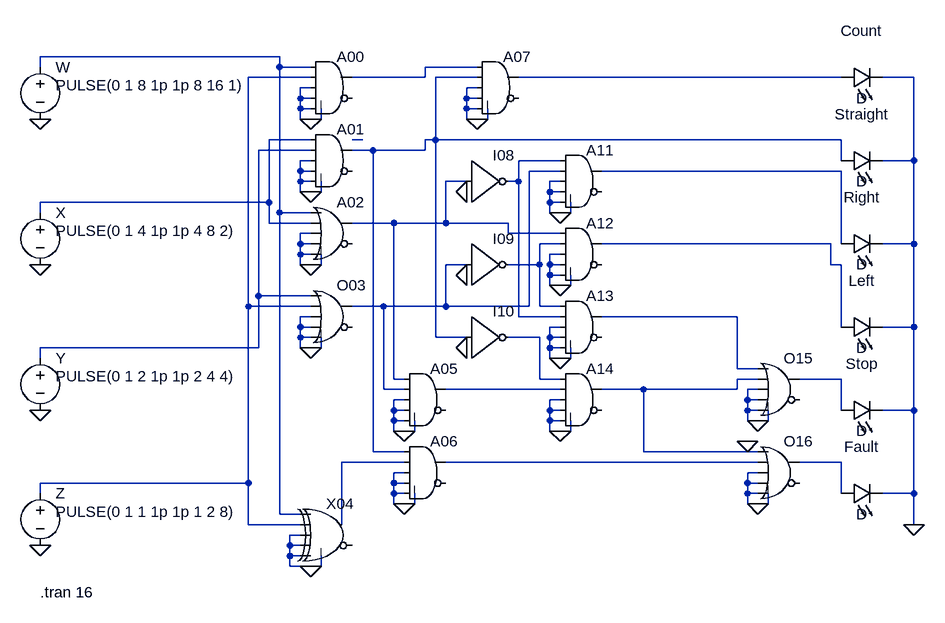
[diagram p0: schematic Prac_1_Analog_sim.asc]
Prac_1_Analog_sim.asc, the LTspice schematic file:
Version 4.1
SHEET 1 880 680
WIRE -464 -400 -832 -400
WIRE -832 -384 -832 -400
WIRE -464 -384 -464 -400
WIRE -416 -384 -464 -384
WIRE -160 -384 -240 -384
WIRE -416 -368 -512 -368
WIRE -240 -368 -240 -384
WIRE -240 -368 -352 -368
WIRE -160 -368 -224 -368
WIRE 400 -368 -96 -368
WIRE 512 -368 464 -368
WIRE -416 -352 -432 -352
WIRE -160 -352 -176 -352
WIRE -432 -336 -432 -352
WIRE -416 -336 -432 -336
WIRE -176 -336 -176 -352
WIRE -160 -336 -176 -336
WIRE -432 -320 -432 -336
WIRE -416 -320 -432 -320
WIRE -176 -320 -176 -336
WIRE -160 -320 -176 -320
WIRE -432 -304 -432 -320
WIRE -416 -304 -432 -304
WIRE -400 -304 -400 -320
WIRE -400 -304 -416 -304
WIRE -176 -304 -176 -320
WIRE -160 -304 -176 -304
WIRE -144 -304 -144 -320
WIRE -144 -304 -160 -304
WIRE -416 -272 -480 -272
WIRE -336 -272 -352 -272
WIRE -224 -272 -224 -368
WIRE -224 -272 -240 -272
WIRE 400 -272 -224 -272
WIRE -416 -256 -496 -256
WIRE -320 -256 -352 -256
WIRE -240 -256 -240 -272
WIRE -240 -256 -320 -256
WIRE -416 -240 -432 -240
WIRE -32 -240 -96 -240
WIRE 400 -240 400 -272
WIRE 512 -240 512 -368
WIRE 512 -240 464 -240
WIRE -432 -224 -432 -240
WIRE -416 -224 -432 -224
WIRE -32 -224 -80 -224
WIRE 400 -224 32 -224
WIRE -432 -208 -432 -224
WIRE -416 -208 -432 -208
WIRE -176 -208 -208 -208
WIRE -96 -208 -96 -240
WIRE -96 -208 -112 -208
WIRE -32 -208 -48 -208
WIRE -432 -192 -432 -208
WIRE -416 -192 -432 -192
WIRE -400 -192 -400 -208
WIRE -400 -192 -416 -192
WIRE -48 -192 -48 -208
WIRE -32 -192 -48 -192
WIRE -480 -176 -480 -272
WIRE -480 -176 -832 -176
WIRE -48 -176 -48 -192
WIRE -32 -176 -48 -176
WIRE -832 -160 -832 -176
WIRE -464 -160 -464 -384
WIRE -416 -160 -464 -160
WIRE -48 -160 -48 -176
WIRE -32 -160 -48 -160
WIRE -16 -160 -16 -176
WIRE -16 -160 -32 -160
WIRE -480 -144 -480 -176
WIRE -416 -144 -480 -144
WIRE -288 -144 -352 -144
WIRE -208 -144 -208 -208
WIRE -208 -144 -288 -144
WIRE -112 -144 -208 -144
WIRE -416 -128 -432 -128
WIRE -112 -128 -112 -144
WIRE -32 -128 -112 -128
WIRE -432 -112 -432 -128
WIRE -416 -112 -432 -112
WIRE -32 -112 -64 -112
WIRE 384 -112 32 -112
WIRE 400 -112 400 -224
WIRE 512 -112 512 -240
WIRE 512 -112 464 -112
WIRE -432 -96 -432 -112
WIRE -416 -96 -432 -96
WIRE -32 -96 -48 -96
WIRE -432 -80 -432 -96
WIRE -416 -80 -432 -80
WIRE -400 -80 -400 -96
WIRE -400 -80 -416 -80
WIRE -176 -80 -208 -80
WIRE -64 -80 -64 -112
WIRE -64 -80 -112 -80
WIRE -48 -80 -48 -96
WIRE -32 -80 -48 -80
WIRE 384 -80 384 -112
WIRE 400 -80 384 -80
WIRE -48 -64 -48 -80
WIRE -32 -64 -48 -64
WIRE -48 -48 -48 -64
WIRE -32 -48 -48 -48
WIRE -16 -48 -16 -64
WIRE -16 -48 -32 -48
WIRE -496 -32 -496 -256
WIRE -416 -32 -496 -32
WIRE -512 -16 -512 -368
WIRE -416 -16 -512 -16
WIRE -304 -16 -352 -16
WIRE -208 -16 -208 -80
WIRE -208 -16 -304 -16
WIRE -80 -16 -80 -224
WIRE -80 -16 -208 -16
WIRE -64 -16 -64 -80
WIRE -32 -16 -64 -16
WIRE -416 0 -432 0
WIRE -96 0 -96 -208
WIRE -32 0 -96 0
WIRE 240 0 32 0
WIRE -432 16 -432 0
WIRE -416 16 -432 16
WIRE -32 16 -48 16
WIRE 400 16 400 -80
WIRE 512 16 512 -112
WIRE 512 16 464 16
WIRE -432 32 -432 16
WIRE -416 32 -432 32
WIRE -224 32 -224 -272
WIRE -176 32 -224 32
WIRE -64 32 -112 32
WIRE -48 32 -48 16
WIRE -32 32 -48 32
WIRE -496 48 -496 -32
WIRE -496 48 -832 48
WIRE -432 48 -432 32
WIRE -416 48 -432 48
WIRE -400 48 -400 32
WIRE -400 48 -416 48
WIRE -48 48 -48 32
WIRE -32 48 -48 48
WIRE -832 64 -832 48
WIRE -48 64 -48 48
WIRE -32 64 -48 64
WIRE -16 64 -16 48
WIRE -16 64 -32 64
WIRE 240 80 240 0
WIRE 272 80 240 80
WIRE -288 96 -288 -144
WIRE -272 96 -288 96
WIRE -64 96 -64 32
WIRE -32 96 -64 96
WIRE 272 96 240 96
WIRE 400 96 336 96
WIRE -304 112 -304 -16
WIRE -272 112 -304 112
WIRE -32 112 -208 112
WIRE 96 112 32 112
WIRE 240 112 240 96
WIRE 240 112 96 112
WIRE 272 112 256 112
WIRE -272 128 -288 128
WIRE -32 128 -48 128
WIRE 256 128 256 112
WIRE 272 128 256 128
WIRE -288 144 -288 128
WIRE -272 144 -288 144
WIRE -48 144 -48 128
WIRE -32 144 -48 144
WIRE 256 144 256 128
WIRE 272 144 256 144
WIRE 400 144 400 96
WIRE 512 144 512 16
WIRE 512 144 464 144
WIRE -288 160 -288 144
WIRE -272 160 -288 160
WIRE -48 160 -48 144
WIRE -32 160 -48 160
WIRE 256 160 256 144
WIRE 272 160 256 160
WIRE 288 160 288 144
WIRE 288 160 272 160
WIRE -288 176 -288 160
WIRE -272 176 -288 176
WIRE -256 176 -256 160
WIRE -256 176 -272 176
WIRE -48 176 -48 160
WIRE -32 176 -48 176
WIRE -16 176 -16 160
WIRE -16 176 -32 176
WIRE -320 208 -320 -256
WIRE -272 208 -320 208
WIRE 96 208 96 112
WIRE 272 208 96 208
WIRE -272 224 -368 224
WIRE 272 224 -208 224
WIRE 400 224 336 224
WIRE -272 240 -288 240
WIRE 272 240 256 240
WIRE -512 256 -512 -16
WIRE -512 256 -832 256
WIRE -288 256 -288 240
WIRE -272 256 -288 256
WIRE 256 256 256 240
WIRE 272 256 256 256
WIRE -832 272 -832 256
WIRE -288 272 -288 256
WIRE -272 272 -288 272
WIRE 256 272 256 256
WIRE 272 272 256 272
WIRE 400 272 400 224
WIRE 512 272 512 144
WIRE 512 272 464 272
WIRE -288 288 -288 272
WIRE -272 288 -288 288
WIRE -256 288 -256 272
WIRE -256 288 -272 288
WIRE 256 288 256 272
WIRE 272 288 256 288
WIRE 288 288 288 272
WIRE 288 288 272 288
WIRE -464 304 -464 -160
WIRE -432 304 -464 304
WIRE -512 320 -512 256
WIRE -432 320 -512 320
WIRE -368 320 -368 224
WIRE 512 320 512 272
WIRE -432 336 -448 336
WIRE -448 352 -448 336
WIRE -432 352 -448 352
WIRE -448 368 -448 352
WIRE -432 368 -448 368
WIRE -448 384 -448 368
WIRE -416 384 -448 384
WIRE -400 384 -400 368
WIRE -400 384 -416 384
FLAG 512 320 0
FLAG -416 -304 0
FLAG -416 -192 0
FLAG -160 -304 0
FLAG -416 -80 0
FLAG -416 48 0
FLAG -176 -192 0
FLAG -176 -64 0
FLAG -32 176 0
FLAG -32 -160 0
FLAG -32 -48 0
FLAG -32 64 0
FLAG -272 288 0
FLAG -416 384 0
FLAG 272 160 0
FLAG -272 176 0
FLAG 272 288 0
FLAG 256 192 0
FLAG -832 -304 0
FLAG -832 -80 0
FLAG -832 144 0
FLAG -832 352 0
FLAG -176 48 0
DATAFLAG -512 80 ""
DATAFLAG -448 304 ""
SYMBOL Digital\\and -384 -416 R0
SYMATTR InstName A00
SYMBOL LED 400 -352 R270
WINDOW 0 72 32 VTop 2
WINDOW 3 0 32 VBottom 2
SYMATTR InstName Count
SYMBOL LED 400 -96 R270
WINDOW 0 72 32 VTop 2
WINDOW 3 0 32 VBottom 2
SYMATTR InstName Right
SYMBOL LED 400 32 R270
WINDOW 0 72 32 VTop 2
WINDOW 3 0 32 VBottom 2
SYMATTR InstName Left
SYMBOL LED 400 -224 R270
WINDOW 0 72 32 VTop 2
WINDOW 3 0 32 VBottom 2
SYMATTR InstName Straight
SYMBOL LED 400 160 R270
WINDOW 0 72 32 VTop 2
WINDOW 3 0 32 VBottom 2
SYMATTR InstName Stop
SYMBOL LED 400 288 R270
WINDOW 0 72 32 VTop 2
WINDOW 3 0 32 VBottom 2
SYMATTR InstName Fault
SYMBOL Digital\\and -384 -304 R0
SYMATTR InstName A01
SYMBOL Digital\\and -128 -416 R0
SYMATTR InstName A07
SYMBOL Digital\\or -384 -192 R0
SYMATTR InstName A02
SYMBOL Digital\\or -384 -64 R0
SYMATTR InstName O03
SYMBOL Digital\\and 0 -272 R0
SYMATTR InstName A11
SYMBOL Digital\\and 0 -160 R0
SYMATTR InstName A12
SYMBOL Digital\\and 0 -48 R0
SYMATTR InstName A13
SYMBOL Digital\\and -240 64 R0
SYMATTR InstName A05
SYMBOL Digital\\and -240 176 R0
SYMATTR InstName A06
SYMBOL Digital\\or 304 48 R0
SYMATTR InstName O15
SYMBOL Digital\\or 304 176 R0
SYMATTR InstName O16
SYMBOL Digital\\xor -384 272 R0
SYMATTR InstName X04
SYMBOL Digital\\inv -176 -272 R0
SYMATTR InstName I08
SYMBOL Digital\\inv -176 -144 R0
SYMATTR InstName I09
SYMBOL Digital\\and 0 64 R0
SYMATTR InstName A14
SYMBOL Digital\\inv -176 -32 R0
SYMATTR InstName I10
SYMBOL voltage -832 -400 R0
WINDOW 3 24 44 Left 2
WINDOW 123 0 0 Left 0
WINDOW 39 0 0 Left 0
SYMATTR Value PULSE(0 1 8 1p 1p 8 16 1)
SYMATTR InstName W
SYMBOL voltage -832 256 R0
WINDOW 3 24 44 Left 2
WINDOW 123 0 0 Left 0
WINDOW 39 0 0 Left 0
SYMATTR Value PULSE(0 1 1 1p 1p 1 2 8)
SYMATTR InstName Z
SYMBOL voltage -832 48 R0
WINDOW 3 24 44 Left 2
WINDOW 123 0 0 Left 0
WINDOW 39 0 0 Left 0
SYMATTR Value PULSE(0 1 2 1p 1p 2 4 4)
SYMATTR InstName Y
SYMBOL voltage -832 -176 R0
WINDOW 3 24 44 Left 2
WINDOW 123 0 0 Left 0
WINDOW 39 0 0 Left 0
SYMATTR Value PULSE(0 1 4 1p 1p 4 8 2)
SYMATTR InstName X
TEXT -832 424 Left 2 !.tran 16

The netlist it stands for:
* Prac_1_Analog_sim.asc
A00 N001 N003 0 0 0 0 N002 0 AND
D§Count N005 0 D
D§Right N011 0 D
D§Left N014 0 D
D§Straight N004 0 D
D§Stop N018 0 D
D§Fault N022 0 D
A01 N006 N008 0 0 0 0 N004 0 AND
A07 N002 N004 0 0 0 0 N005 0 AND
A02 N001 N006 0 0 0 0 N012 0 OR
A§O03 N008 N003 0 0 0 0 N010 0 OR
A11 N009 N010 0 0 0 0 N011 0 AND
A12 N012 N013 0 0 0 0 N014 0 AND
A13 N013 N009 0 0 0 0 N015 0 AND
A05 N012 N010 0 0 0 0 N019 0 AND
A06 N004 N020 0 0 0 0 N021 0 AND
A§O15 N015 N017 0 0 0 0 N018 0 OR
A§O16 N017 N021 0 0 0 0 N022 0 OR
A§X04 N001 N003 0 0 0 0 N020 0 XOR
A§I08 N012 0 0 0 0 N009 0 0 BUF
A§I09 N010 0 0 0 0 N013 0 0 BUF
A14 N016 N019 0 0 0 0 N017 0 AND
A§I10 N004 0 0 0 0 N016 0 0 BUF
V§W N001 0 PULSE(0 1 8 1p 1p 8 16 1)
V§Z N003 0 PULSE(0 1 1 1p 1p 1 2 8)
V§Y N008 0 PULSE(0 1 2 1p 1p 2 4 4)
V§X N006 0 PULSE(0 1 4 1p 1p 4 8 2)
.model D D
.lib standard.dio
.tran 16
.backanno
.end